# Altium schematic sheet Motor_Encoder.SchDoc: Controlador PID
size A4; Organization: Altium Limited; Address1: L3, 12a Rodborough Rd; Address2: Frenchs Forest; Address3: NSW; Address4: Australia 2086; Revision: R01; sheetnumberh: 4; sheettotall: 5; Alumno: Irumberry Iván - Matwiejczuk Leandro; Curso: 512; Materia: Técnicas Digitales III; Docentes: Ing. Marín Ariel; SheetNumber: 4; SheetTotal: 5
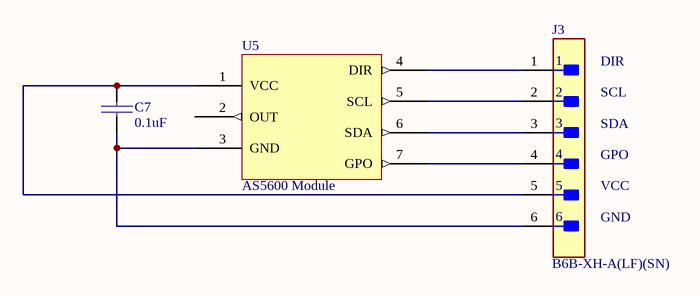
[diagram p0: Motor_Encoder.SchDoc]

## Parts
C7  0.1uF  [CAP_Axial_0.2mm]  (graphical)
J3  B6B-XH-A(LF)(SN)  [JST 6 PIN CONNECTOR]  (graphical)
U5  AS5600 Module  [AS5600 Module]  (graphical)

## Nets
NetC7_1: C7.1 J3.5 U5.1(VCC)
NetC7_2: C7.2 J3.6 U5.3(GND)
NetJ3_1: J3.1 U5.4(DIR)
NetJ3_2: J3.2 U5.5(SCL)
NetJ3_3: J3.3 U5.6(SDA)
NetJ3_4: J3.4 U5.7(GPO)

Not connected (* = marked no-connect by the designer): U5 2(OUT)

## Notes on the sheet
- (near J3) DIR
- (near J3) SCL
- (near J3) SDA
- (near J3) GPO
- (near J3) VCC
- (near J3) GND
- Title:
- Revision:
- Alumnos:
- Materia:
- Docente:
- Curso:
- File:
- Date:
- Sheet
- of

## Library data of the parts
C7 = CAP_NP: Non-Polarized Capacitor
J3 = JST 6 PIN: CONN HEADER VERT 6POS 2.5MM
U5 = AS5600 Module: AS5600 Magnetic Angle Sensor Encoder Module